# EAGLE schematic base (EAGLE 6.5.0)
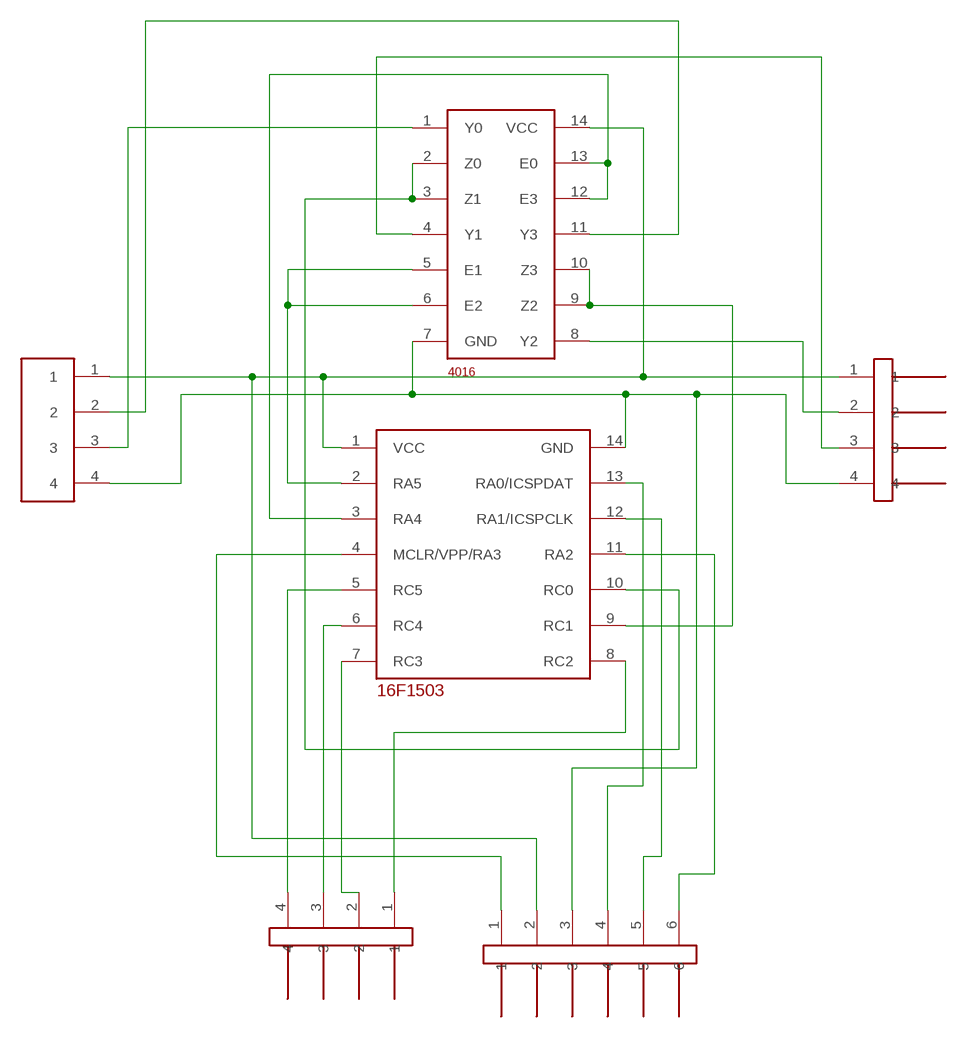
[diagram p0: schematic, sheet 1]

## Parts
U$1  16F1503  [16F1503]
U$2  4016  [SO14]
U$3  JUMPER4  [JUMPER4]
U$4  JUMPER4F  [JUMPER4F]
U$5  JUMPER4M  [JUMPER4M]
U$6  JUMPER6M  [JUMPER6M]

## Nets
N$1: U$1.14(GND) U$2.7(GND) U$3.4 U$4.4 U$6.3
N$2: U$1.1(VCC) U$2.14(VCC) U$3.1 U$4.1 U$6.2
N$3: U$2.1(Y0) U$4.3
N$4: U$1.9(RC1) U$2.9(Z2) U$2.10(Z3)
N$5: U$1.2(RA5) U$2.5(E1) U$2.6(E2)
N$6: U$1.3(RA4) U$2.12(E3) U$2.13(E0)
N$7: U$1.10(RC0) U$2.2(Z0) U$2.3(Z1)
N$8: U$2.4(Y1) U$3.3
N$9: U$2.11(Y3) U$4.2
N$10: U$2.8(Y2) U$3.2
N$11: U$1.11(RA2) U$6.6
N$12: U$1.5(RC5) U$5.4
N$13: U$1.4(MCLR/VPP/RA3) U$6.1
N$14: U$1.13(RA0/ICSPDAT) U$6.4
N$15: U$1.12(RA1/ICSPCLK) U$6.5
N$16: U$1.6(RC4) U$5.3
N$17: U$1.7(RC3) U$5.2
N$18: U$1.8(RC2) U$5.1

## Library data of the parts
U$1 = !stavebnice03:16F1503
U$2 = !stavebnice03:4016
U$3 = !stavebnice03:JUMPER4
U$4 = !stavebnice03:JUMPER4F
U$5 = !stavebnice03:JUMPER4M
U$6 = !stavebnice03:JUMPER6M